# EAGLE design SpindlePidLcdStandAlone (EAGLE 6.3)
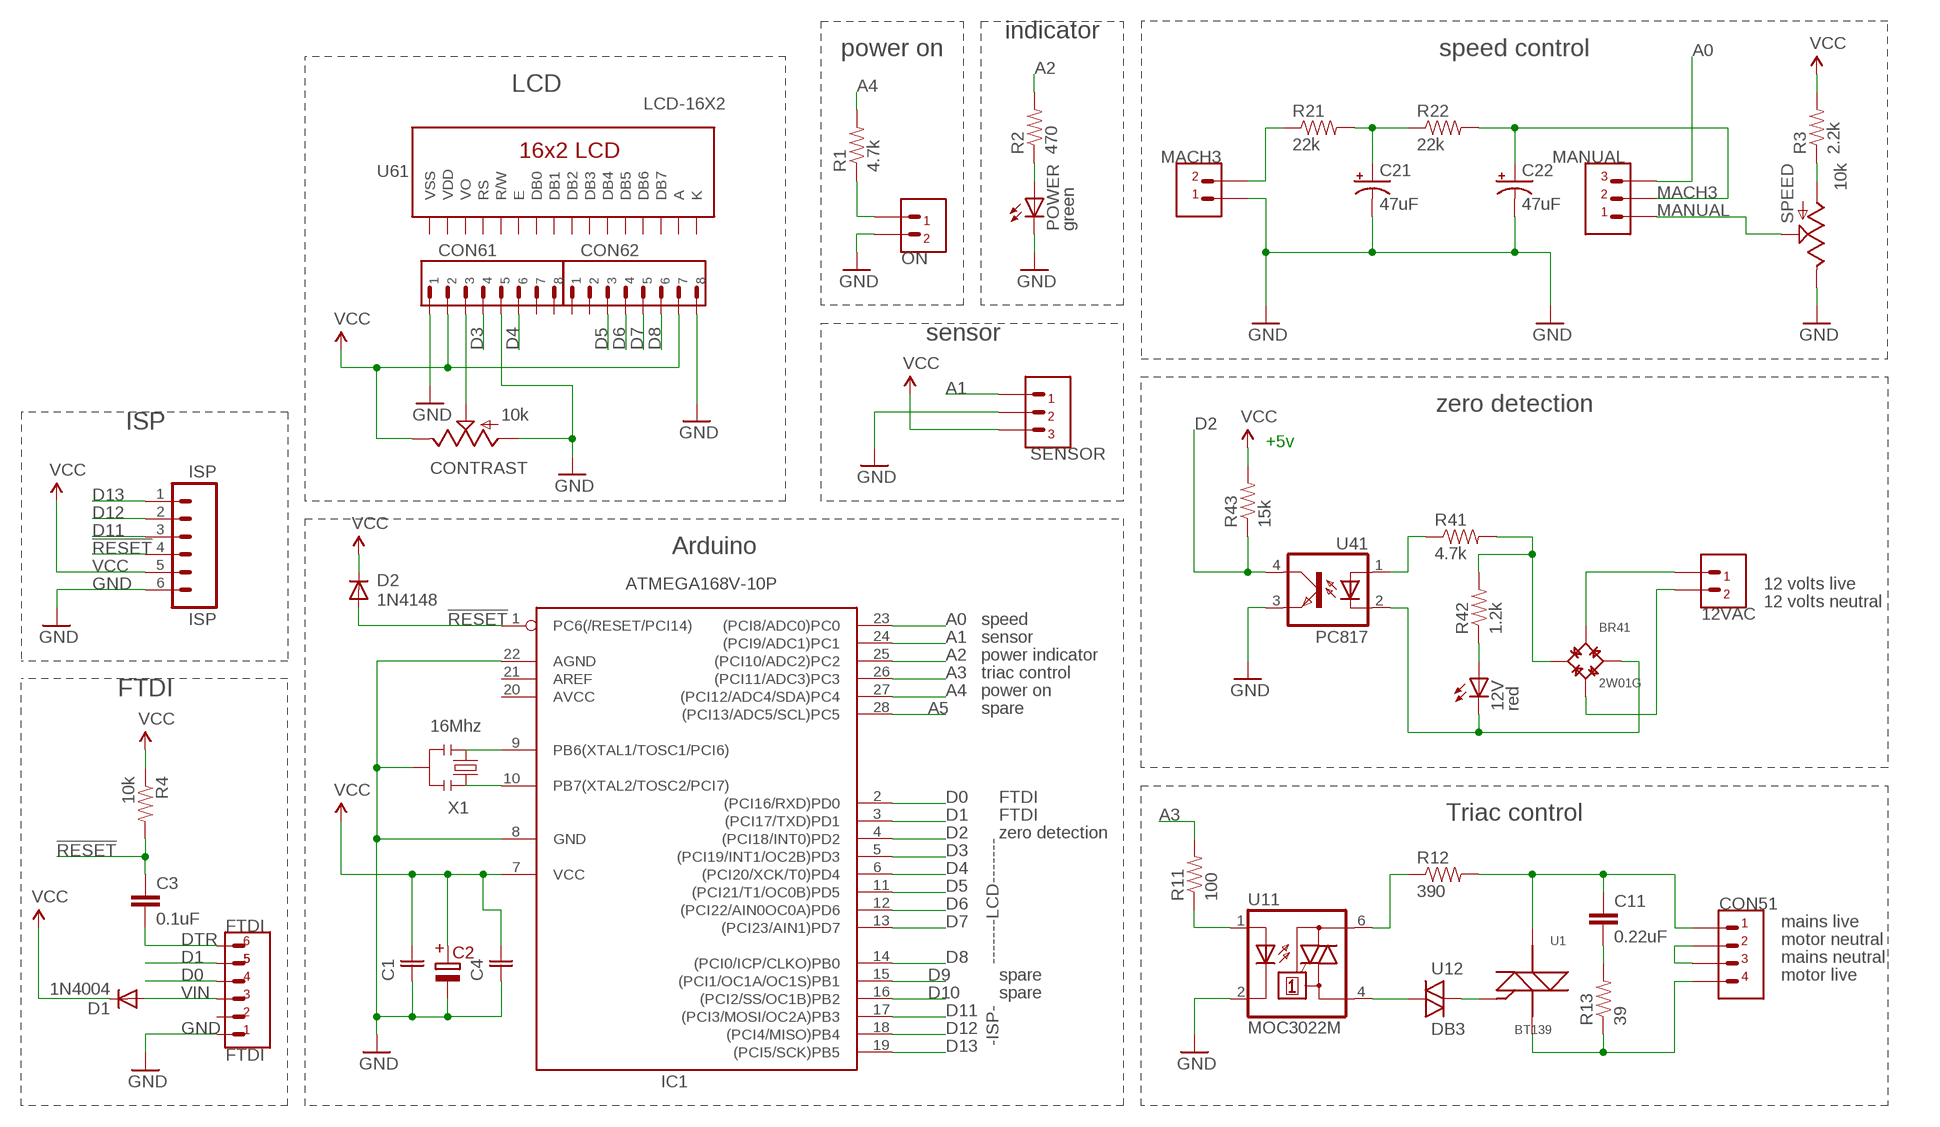
[diagram p0: schematic, sheet 1]

## Parts
12V  red  LED5MM  [LED5MM]
12VAC  2PIN  [2PIN]
BR41  2W01G  DIODEBRIDGE  [DIODEBRIDGE]
C1  0.1UF  [0.1UF]
C2  CAPACITOR  [CAPACITOR]
C3  0.1uF  CAPPTH  [CAP-PTH-SMALL]
C4  0.1UF  [0.1UF]
C11  0.22uF  CAPPTH  [CAP-PTH-SMALL]
C21  47uF  CAP_POLPTH2  [CPOL-RADIAL-10UF-25V]
C22  47uF  CAP_POLPTH2  [CPOL-RADIAL-10UF-25V]
CON51  4PIN  [4PIN]
CON61  8PINHEADER  [8PINHEADER]
CON62  8PINHEADER  [8PINHEADER]
CONTRAST  10k  POT  [ALPS_POT]
D1  1N4004  [DO41-10]
D2  1N4148  1N4004  [DO41-10]
FTDI  FTDI  6PINHEADER0.1"  [6PINHEADER]
IC1  ATMEGA168V-10P  [DIL28-3]
ISP  ISP  M06SIP  [1X06]
MACH3  2PIN  [2PIN]
MANUAL  3PIN  [3PIN]
ON  2PIN  [2PIN]
POWER  green  LED5MM  [LED5MM]
R1  4.7k  RESISTORPTH-1/4W  [AXIAL-0.4]
R2  470  RESISTORPTH-1/6W  [1/6W-RES]
R3  2.2k  RESISTORPTH-1/6W  [1/6W-RES]
R4  10k  RESISTORPTH-1/4W  [AXIAL-0.4]
R11  100  RESISTORPTH-1/6W  [1/6W-RES]
R12  390  RESISTORPTH-1/6W  [1/6W-RES]
R13  39  RESISTORPTH-1/6W  [1/6W-RES]
R21  22k  RESISTORPTH-1/6W  [1/6W-RES]
R22  22k  RESISTORPTH-1/6W  [1/6W-RES]
R41  4.7k  RESISTORPTH-1/6W  [1/6W-RES]
R42  1.2k  RESISTORPTH-1/6W  [1/6W-RES]
R43  15k  RESISTORPTH-1/6W  [1/6W-RES]
SENSOR  3PIN  [3PIN]
SPEED  10k  POT  [ALPS_POT]
U1  BT139  TRIAC  [TRIAC]
U11  MOC3022M  [DIL06]
U12  DB3  DIAC-DO35-10  [DO35-10]
U41  PC817  [DIL04]
U61  LCD-16X2  LCD-16X2SILK  [LCD-16X2]
X1  16Mhz  RESONATORPTH  [RESONATOR-PTH]

## Nets
!RESET: C3.1 D2.A IC1.1(PC6(/RESET/PCI14)) ISP.4 R4.P$2
A0: IC1.23((PCI8/ADC0)PC0) MANUAL.P$3
A1: IC1.24((PCI9/ADC1)PC1) SENSOR.P$1
A2: IC1.25((PCI10/ADC2)PC2) R2.2
A3: IC1.26((PCI11/ADC3)PC3) R11.2
A4: IC1.27((PCI12/ADC4/SDA)PC4) R1.P$2
A5: IC1.28((PCI13/ADC5/SCL)PC5)
D0: FTDI.P$4 IC1.2((PCI16/RXD)PD0)
D1: FTDI.P$5 IC1.3((PCI17/TXD)PD1)
D2: IC1.4((PCI18/INT0)PD2) R43.1 U41.4(COL)
D3: CON61.P$4 IC1.5((PCI19/INT1/OC2B)PD3)
D4: CON61.P$6 IC1.6((PCI20/XCK/T0)PD4)
D5: CON62.P$3 IC1.11((PCI21/T1/OC0B)PD5)
D6: CON62.P$4 IC1.12((PCI22/AIN0OC0A)PD6)
D7: CON62.P$5 IC1.13((PCI23/AIN1)PD7)
D8: CON62.P$6 IC1.14((PCI0/ICP/CLKO)PB0)
D9: IC1.15((PCI1/OC1A/OC1S)PB1)
D10: IC1.16((PCI2/SS/OC1B)PB2)
D11: IC1.17((PCI3/MOSI/OC2A)PB3) ISP.3
D12: IC1.18((PCI4/MISO)PB4) ISP.2
D13: IC1.19((PCI5/SCK)PB5) ISP.1
DTR: C3.2 FTDI.P$6
GND: C1.P$1 C2.-(-VE) C4.P$1 C21.2(-) C22.2(-) CON61.P$1 CON61.P$5 CON62.P$8 CONTRAST.P$3(A) FTDI.P$1 IC1.8(GND) IC1.22(AGND) ISP.6 MACH3.P$1 ON.P$2 POWER.K(C) SENSOR.P$2 SPEED.P$1(E) U11.2(C) U41.3(EMIT) X1.2
MACH3: C22.1(+) MANUAL.P$2 R22.2
MACH3_PWM: MACH3.P$2 R21.1
MAINS_LIVE: C11.1 CON51.P$1 R12.2 U1.2(A)
MANUAL: MANUAL.P$1 SPEED.P$2(S)
MOTOR_LIVE: CON51.P$4 R13.1 U1.3(C)
N$1: U1.1(B) U12.C
N$2: C21.1(+) R21.2 R22.1
N$3: U11.4(A1) U12.A
N$4: POWER.A R2.1
N$5: C11.2 R13.2
N$6: 12V.A R42.1
N$7: R41.1 U41.1(A)
N$8: 12V.K(C) BR41.- U41.2(C)
N$9: BR41.+ R41.2 R42.2
N$10: R3.1 SPEED.P$3(A)
N$11: IC1.9(PB6(XTAL1/TOSC1/PCI6)) X1.1
N$12: ON.P$1 R1.P$1
N$13: R11.1 U11.1(A)
N$14: 12VAC.P$1 BR41.AC1
N$15: R12.1 U11.6(A2)
N$16: 12VAC.P$2 BR41.AC2
N$17: CON61.P$3 CONTRAST.P$2(S)
N$18: IC1.10(PB7(XTAL2/TOSC2/PCI7)) X1.3
NEUTRAL: CON51.P$2 CON51.P$3
VCC: C1.P$2 C2.+(+VE) C4.P$2 CON61.P$2 CON62.P$7 CONTRAST.P$1(E) D1.C D2.C IC1.7(VCC) ISP.5 R3.2 R4.P$1 R43.2 SENSOR.P$3
VIN: D1.A FTDI.P$3
Unconnected: CON61.P$7 CON61.P$8 CON62.P$1 CON62.P$2 FTDI.P$2 IC1.20(AVCC) IC1.21(AREF) U61.3(VO) U61.4(RS) U61.5(R/W) U61.6(E) U61.7(DB0) U61.8(DB1) U61.9(DB2) U61.10(DB3) U61.11(DB4) U61.12(DB5) U61.13(DB6) U61.14(DB7)

## Notes on the sheet
- indicator
- power on | speed control
- LCD
- sensor
- zero detection
- ISP
- +5v
- Arduino
- 12 volts live
- 12 volts neutral
- speed
- sensor
- power indicator
- triac control
- FTDI | power on
- spare
- FTDI
- FTDI | Triac control
- zero detection
- -------LCD-------
- mains live
- motor neutral
- mains neutral
- spare | motor live
- spare
- -ISP-

## Power pins joined to a net without a drawn wire
A: U61.15(A)
K: U61.16(K)
VDD: U61.2(VDD)
VSS: U61.1(VSS)

## Library data of the parts
12V POWER = adafruit2012:LED: LED OSRAM: - CHIPLED LG R971, LG N971, LY N971, LG Q971, LY Q971, LO R971, LY R971 LH N974, LH R974 LS Q976, LO Q976, LY Q976 LO Q996 - Hyper CHIPLED LW Q18S LB Q993, LB Q99A, LB R99A - SideLED LS A670, LO A670, LY A670, LG A670, LP A670 LB A673, LV A673, LT A673, LW A673 LH A674 LY A675 LS A676, LA A676, LO A676, LY A676, LW A676 LS A679, LY A679, LG A679 - Hyper Micro SIDELED® LS Y876, LA Y876, LO Y876, LY Y876 LT Y87S - SmartLED LW L88C, LW L88S LB L89C, LB L89S, LG L890 LS L89K, LO L89K, LY L89K LS L896, LA L896, LO L896, LY L896 - TOPLED LS T670, LO T670, LY T670, LG T670, LP T670 LSG T670, LSP T670, LSY T670, LOP T670, LYG T670 LG T671, LOG T671, LSG T671 LB T673, LV T673, LT T673, LW T673 LH T674 LS T676, LA T676, LO T676, LY T676, LB T676, LH T676, LSB T676, LW T676 LB T67C, LV T67C, LT T67C, LS T67K, LO T67K, LY T67K, LW E67C LS E67B, LA E67B, LO E67B, LY E67B, LB E67C, LV E67C, LT E67C LW T67C LS T679, LY T679, LG T679 LS T770, LO T770, LY T770, LG T770, LP T770 LB T773, LV T773, LT T773, LW T773 LH T774 LS E675, LA E675, LY E675, LS T675 LS T776, LA T776, LO T776, LY T776, LB T776 LHGB T686 LT T68C, LB T68C - Hyper Mini TOPLED® LB M676 - Mini TOPLED Santana® LG M470 LS M47K, LO M47K, LY M47K Source: http://www.osram.convergy.de/
12VAC MACH3 ON = connectors:2PIN
BR41 = connectors:DIODEBRIDGE
C1 C4 = passives:0.1UF: 0.1uF 0.2" pitch
C2 = passives:CAPACITOR
C3 C11 = SparkFun:CAP: Capacitor Standard 0603 ceramic capacitor, and 0.1" leaded capacitor.
C21 C22 = SparkFun:CAP_POL: Capacitor Polarized These are standard SMD and PTH capacitors. Normally 10uF, 47uF, and 100uF in electrolytic and tantalum varieties. Always verify the external diameter of the through hole cap, it varies with capacity, voltage, and manufacturer. The EIA devices should be standard.
CON51 = connectors:4PIN
CON61 CON62 = connectors:8PINHEADER
CONTRAST SPEED = SparkFun:POT
D1 D2 = adafruit2012:1N4004: DIODE General purpose 1N400x type rectifier (With bigger pads) http://www.ladyada.net/library/pcb/eaglelibrary.html
FTDI = connectors:6PINHEADER
IC1 = adafruit2012:ATMEGA168*P: MICROCONTROLLER 16 kBytes FLASH 1 kBytes SRAM 512 Bytes EEPROM USART 8-channel 10 bit ADC
ISP = SparkFun:M06: Header 6 Standard 6-pin 0.1" header. Use with straight break away headers (SKU : PRT-00116), right angle break away headers (PRT-00553), swiss pins (PRT-00743), machine pins (PRT-00117), and female headers (PRT-00115). Molex polarized connector foot print use with SKU : PRT-08094 with associated crimp pins and housings. NOTES ON THE VARIANTS LOCK and LOCK_LONGPADS... This footprint was designed to help hold the alignment of a through-hole component (i.e. 6-pin header) while soldering it into place. You may notice that each hole has been shifted either up or down by 0.005 of an inch from it's more standard position (which is a perfectly straight line). This slight alteration caused the pins (the squares in the middle) to touch the edges of the holes. Because they are alternating, it causes a "brace" to hold the component in place. 0.005 has proven to be the perfect amount of "off-center" position when using our standard breakaway headers. Although looks a little odd when you look at the bare footprint, once you have a header in there, the alteration is very hard to notice. Also, if you push a header all the way into place, it is covered up entirely on the bottom side. This idea of altering the position of holes to aid alignment will be further integrated into the Sparkfun Library for other footprints. It can help hold any component with 3 or more connection pins.
MANUAL SENSOR = connectors:3PIN
R1-R4 R11-R13 R21 R22 R41-R43 = SparkFun:RESISTOR: Resistor Basic schematic elements and footprints for 0603, 1206, and PTH resistors.
U1 = connectors:TRIAC
U11 = optocoupler:MOC30*M: RANDOM-PHASE OPTOISOLATORS TRIAC DRIVER OUTPUT Source: http://www.fairchildsemi.com MOC3020-M.pdf; MF: FAIRCHILD SEMICONDUCTOR; MPN: MOC3022-M; OC_FARNELL: 1021086; OC_NEWARK: 58K1956
U12 = diode:DIAC-: DIAC
U41 = optocoupler:PC817: SHARP OPTO COUPLER; MPN: PC817X4J000F; OC_FARNELL: 9707727; OC_NEWARK: 97K7059
U61 = SparkFun:LCD-16X2
X1 = SparkFun:RESONATOR: Resonator Small SMD resonator. This is the itty bitty 10/20MHz resonators with built in caps. CSTCE10M0G55 and CSTCE20M0V53. Footprint has been reviewed closely but hasn't been tested yet.

## Board
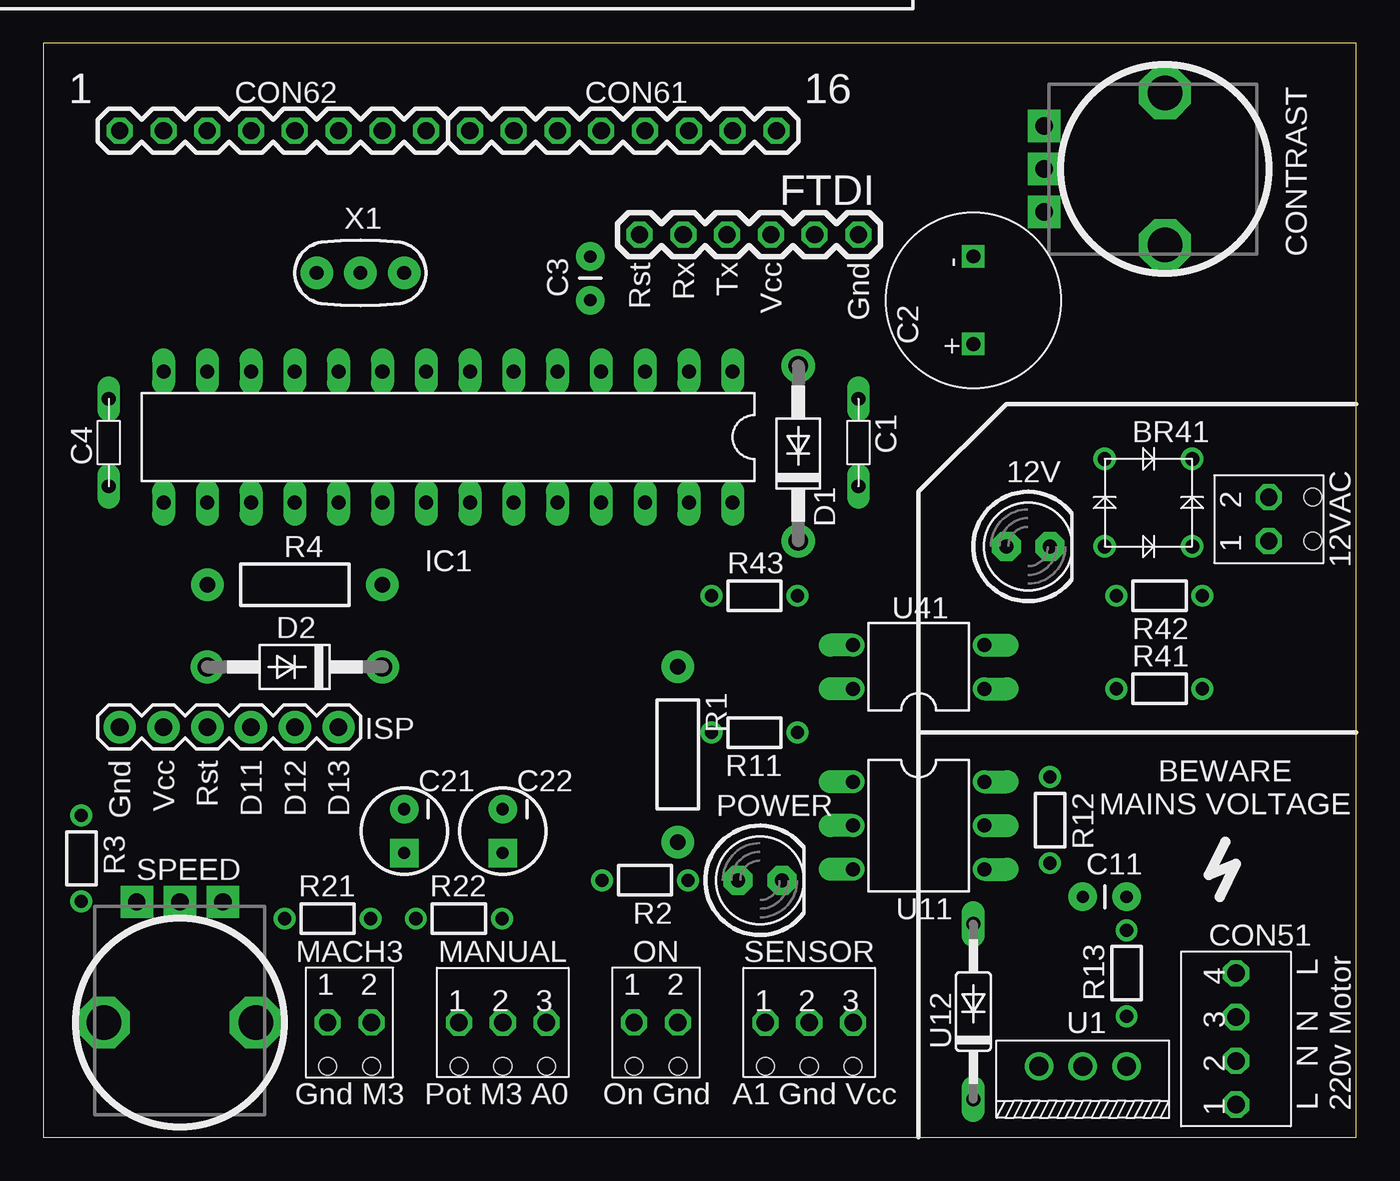
[diagram p1: board, top side]
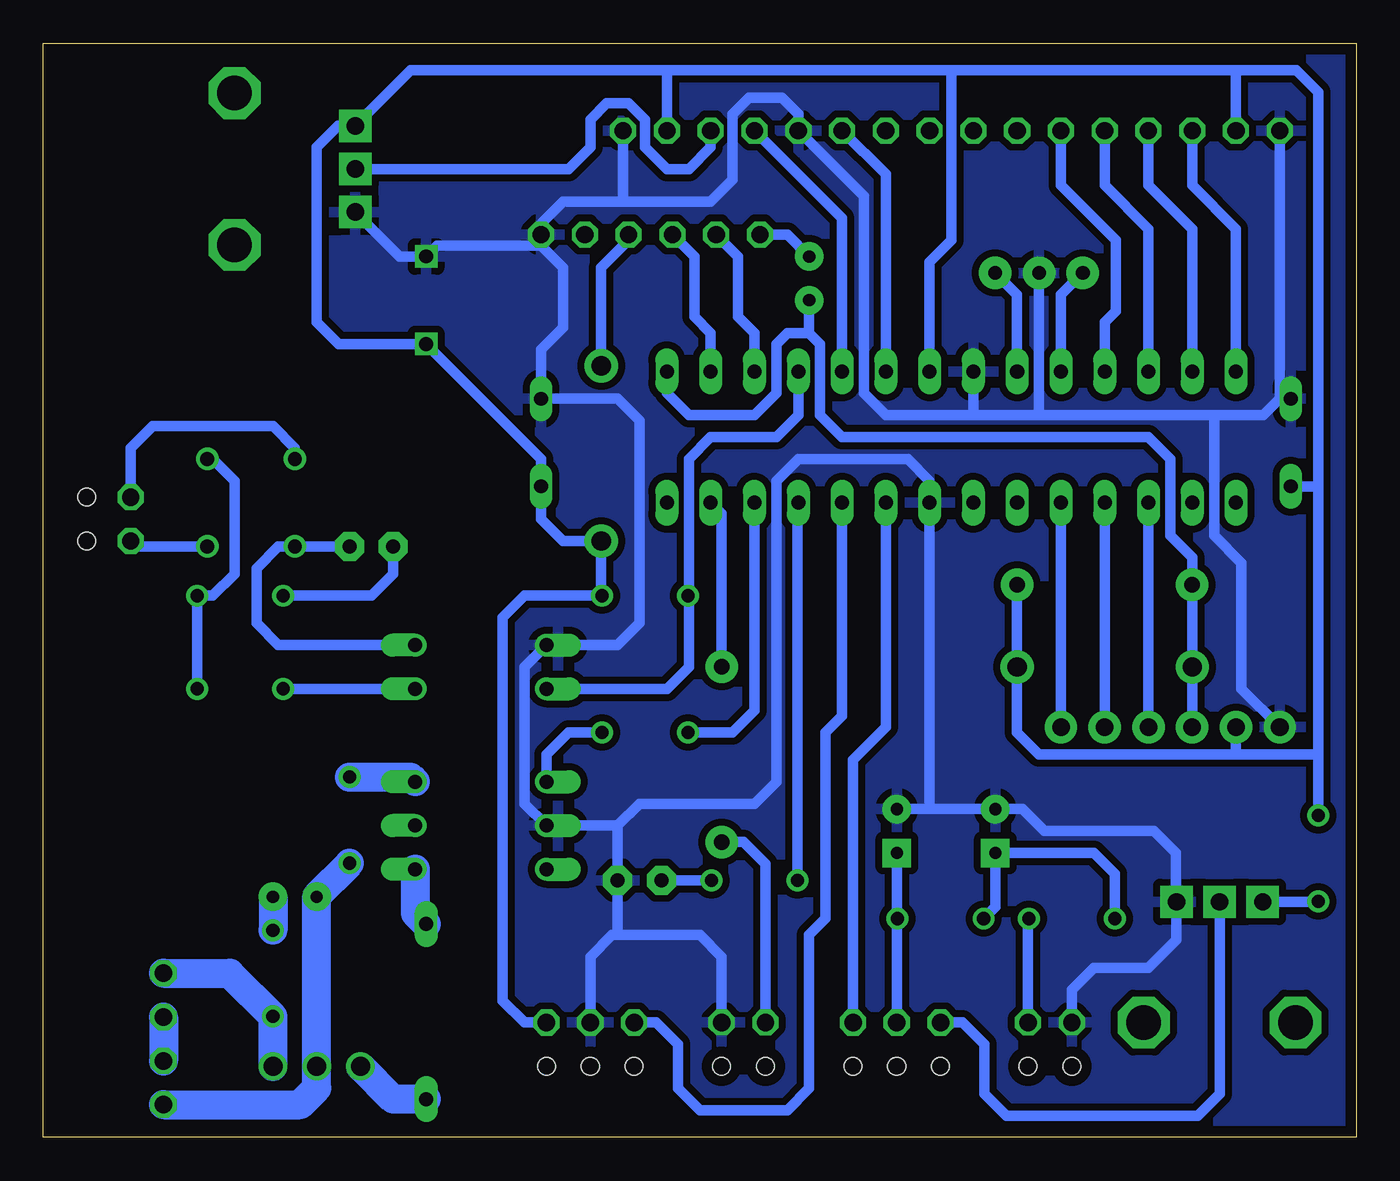
[diagram p2: board, bottom side, seen from below]

Size 76.2 x 63.5 mm. Coordinates in mm from the lower left corner, seen from the top.
Outline: 0,0 76.2,0 76.2,63.5 0,63.5 0,0
Copper layers (1*16): Top 0.035mm / dielectric 1.5mm / Bottom 0.035mm
Design rules "default *": minimum track width 10mil, minimum drill 24mil, track to track 16mil, track to pad 8mil, pad to pad 16mil, via to via 8mil, smd to smd 8mil, copper to edge 25mil, drill to drill 16mil, minimum pad ring 10mil, minimum via ring 8mil, stop-mask expansion 4mil, vias tented up to drill 0mil, thermal gap 16mil

### Footprints (pad centres in the part's own frame; a part is rotated, then mirrored left to right if it is on the bottom)
LED5MM = drill 0.813 pad 1.676 octagon: A -1.27,0; K 1.27,0
2PIN = drill 1 octagon: P$1 -1.27,0; P$2 1.27,0 | hole 1: -1.27,-2.54; 1.27,-2.54
DIODEBRIDGE = drill 0.8: + -2.54,2.54; - 2.54,-2.54; AC1 2.54,2.54; AC2 -2.54,-2.54
0.1UF = drill 0.8 long: P$1 -2.54,0; P$2 2.54,0
CAPACITOR = drill 0.8 square: + -2.54,0; - 2.54,0
CAP-PTH-SMALL = drill 0.7 pad 1.651: 1 0,0; 2 2.54,0
CPOL-RADIAL-10UF-25V = drill 0.7 pad 1.651 square: 1 1.27,0 | drill 0.7 pad 1.651: 2 -1.27,0
4PIN = drill 1.016 octagon: P$1 -3.81,0; P$2 -1.27,0; P$3 1.27,0; P$4 3.81,0
8PINHEADER = drill 1 octagon: P$1 -8.89,0; P$2 -6.35,0; P$3 -3.81,0; P$4 -1.27,0; P$5 1.27,0; P$6 3.81,0; P$7 6.35,0; P$8 8.89,0
ALPS_POT = drill 1 pad 1.88 square: P$1 7,-2.5; P$2 7,0; P$3 7,2.5 | drill 2 octagon: P$4 0,-4.4; P$5 0,4.4
DO41-10 = drill 1.118 pad 1.93: A 5.08,0; C -5.08,0
6PINHEADER = drill 1 octagon: P$1 -6.35,0; P$2 -3.81,0; P$3 -1.27,0; P$4 1.27,0; P$5 3.81,0; P$6 6.35,0
DIL28-3 = drill 0.813 long: 1 -16.51,-3.81; 2 -13.97,-3.81; 3 -11.43,-3.81; 4 -8.89,-3.81; 5 -6.35,-3.81; 6 -3.81,-3.81; 7 -1.27,-3.81; 8 1.27,-3.81; 9 3.81,-3.81; 10 6.35,-3.81; 11 8.89,-3.81; 12 11.43,-3.81; 13 13.97,-3.81; 14 16.51,-3.81; 15 16.51,3.81; 16 13.97,3.81; 17 11.43,3.81; 18 8.89,3.81; 19 6.35,3.81; 20 3.81,3.81; 21 1.27,3.81; 22 -1.27,3.81; 23 -3.81,3.81; 24 -6.35,3.81; 25 -8.89,3.81; 26 -11.43,3.81; 27 -13.97,3.81; 28 -16.51,3.81
1X06 = drill 1.016 pad 1.88: 1 0,0; 2 2.54,0; 3 5.08,0; 4 7.62,0; 5 10.16,0; 6 12.7,0
3PIN = drill 1.016 octagon: P$1 -2.54,0; P$2 0,0; P$3 2.54,0 | hole 1.016: -2.54,-2.54; 0,-2.54; 2.54,-2.54
AXIAL-0.4 = drill 0.9 pad 1.88: P$1 -5.08,0; P$2 5.08,0
1/6W-RES = drill 0.762: 1 -2.5,0; 2 2.5,0
TRIAC = drill 1.1: 1 -2.54,0; 2 0,0; 3 2.54,0
DIL06 = drill 0.813 offset: 1 -2.54,-3.81; 2 0,-3.81; 3 2.54,-3.81; 4 2.54,3.81; 5 0,3.81; 6 -2.54,3.81
DO35-10 = drill 0.813 long: A 5.08,0; C -5.08,0
DIL04 = drill 0.813 offset: 1 -1.27,-3.81; 2 1.27,-3.81; 3 1.27,3.81; 4 -1.27,3.81
LCD-16X2 = drill 1.016 pad 1.88 square: 1 -32,15.5 | drill 1.016 pad 1.88: 2 -29.46,15.5; 3 -26.92,15.5; 4 -24.38,15.5; 5 -21.84,15.5; 6 -19.3,15.5; 7 -16.76,15.5; 8 -14.22,15.5; 9 -11.68,15.5; 10 -9.14,15.5; 11 -6.6,15.5; 12 -4.06,15.5; 13 -1.52,15.5; 14 1.02,15.5; 15 3.56,15.5; 16 6.1,15.5 | hole 2.8: -37.5,15.5; -37.5,-15.5; 37.5,15.5; 37.5,-15.5
RESONATOR-PTH = drill 0.8 pad 1.88: 1 -2.54,0; 2 0,0; 3 2.54,0

### Placement (x,y rotation side)
12V  57.15,34.29 0 top
12VAC  71.12,35.88 90 top
BR41  64.14,36.83 270 top
C1  47.31,40.32 270 top
C2  53.98,48.58 90 top
C3  31.75,48.58 90 top
C4  3.81,40.32 270 top
C11  60.33,13.97 0 top
C21  20.95,17.78 270 top
C22  26.67,17.78 270 top
CON51  69.22,5.71 90 top
CON61  33.66,58.42 180 top
CON62  13.34,58.42 180 top
CONTRAST  65.09,56.2 180 top
D1  43.81,39.69 90 top
D2  14.61,27.3 180 top
FTDI  40.96,52.39 180 top
IC1  23.5,40.64 180 top
ISP  17.14,23.81 180 top
MACH3  17.78,6.67 0 top
MANUAL  26.67,6.67 0 top
ON  35.56,6.67 0 top
POWER  41.59,14.92 0 top
R1  36.83,22.23 90 top
R2  34.92,14.92 180 top
R3  2.22,16.19 90 top
R4  14.61,32.07 180 top
R11  41.27,23.5 180 top
R12  58.42,18.41 270 top
R13  62.87,9.53 90 top
R21  16.51,12.7 180 top
R22  24.13,12.7 0 top
R41  64.77,26.04 0 top
R42  64.77,31.43 0 top
R43  41.27,31.43 0 top
SENSOR  44.45,6.67 0 top
SPEED  7.94,6.67 90 top
U1  60.33,4.13 0 top
U11  50.8,18.1 270 top
U12  53.98,7.3 90 top
U41  50.8,27.3 90 top
U61  10.48,83.5 180 top  (outside the outline)
X1  18.41,50.16 180 top

### Tracks (layer width: path | path; a pad name or v marks a point on that pad's centre or on a via)
!RESET
  Bottom 0.61: IC1.1 40.01,43.18 38.73,41.91 34.92,41.91 33.66,43.18 33.66,46.04 33.02,46.67 31.75,46.67 | 31.75,46.67 31.11,46.04 31.11,41.91 29.84,40.64 12.06,40.64 10.79,39.37 10.79,34.92 9.53,33.66 R4.P$2 D2.A ISP.4 | C3.1 31.75,46.67
A0
  Bottom 0.61: IC1.23 27.3,23.81 29.21,21.91 MANUAL.P$3
A1
  Bottom 0.61: IC1.24 29.84,24.45 30.8,23.5 30.8,12.7 31.75,11.75 31.75,2.86 33.02,1.59 38.1,1.59 39.37,2.86 39.37,5.4 40.64,6.67 SENSOR.P$1
A2
  Bottom 0.61: R2.2 32.42,36.79 IC1.25
A3
  Bottom 0.61: R11.2 36.2,23.5 34.92,24.77 IC1.26
A4
  Bottom 0.61: R1.P$2 36.83,36.2 IC1.27
D0
  Bottom 0.61: FTDI.P$4 38.42,51.12 38.42,47.62 37.47,46.67 IC1.2
D1
  Bottom 0.61: FTDI.P$5 35.88,51.12 35.88,47.62 34.92,46.67 IC1.3
D2
  Bottom 0.61: 38.73,31.43 38.73,27.3 40.01,26.04 U41.4 | 38.73,31.43 38.73,39.37 37.47,40.64 33.66,40.64 32.38,41.91 IC1.4 | R43.1 38.73,31.43
D3
  Bottom 0.61: IC1.5 29.84,53.34 CON61.P$4
D4
  Bottom 0.61: IC1.6 27.3,55.88 CON61.P$6
D5
  Bottom 0.61: CON62.P$3 17.14,55.24 13.97,52.07 13.97,47.94 14.61,47.31 IC1.11
D6
  Bottom 0.61: IC1.12 12.06,52.7 14.61,55.24 CON62.P$4
D7
  Bottom 0.61: IC1.13 9.53,52.7 12.06,55.24 CON62.P$5
D8
  Bottom 0.61: IC1.14 6.99,52.7 9.53,55.24 CON62.P$6
D11
  Bottom 0.61: ISP.3 IC1.17
D12
  Bottom 0.61: ISP.2 IC1.18
D13
  Bottom 0.61: ISP.1 IC1.19
DTR
  Bottom 0.61: FTDI.P$6 33.02,52.39 C3.2
GND
  Bottom 0.61: 24.77,19.05 C21.2 19.37,19.05 18.1,17.78 11.75,17.78 10.48,16.51 10.48,13.71 SPEED.P$1 10.44,11.47 12.06,9.84 15.24,9.84 16.51,8.57 MACH3.P$1 | X1.2 18.41,41.91 | 18.41,41.91 8.26,41.91 | 8.26,41.91 5.4,41.91 4.45,42.86 | 4.45,42.86 CON62.P$8 | 22.23,41.91 27.3,41.91 28.57,43.18 28.57,54.61 CON61.P$5 32.38,59.37 33.34,60.33 35.24,60.33 36.2,59.37 36.2,55.56 37.47,54.29 42.55,54.29 | 22.23,41.91 18.41,41.91 | IC1.8 22.23,41.91 | 42.55,54.29 46.04,54.29 47.31,53.02 FTDI.P$1 47.31,51.75 | 47.31,51.75 53.34,51.75 C2.- 55.51,51.12 CONTRAST.P$3 | 47.31,51.75 46.04,50.48 46.04,46.99 47.31,45.72 C1.P$1 42.86,42.86 41.59,41.59 41.59,29.84 42.86,28.57 U41.3 48.26,27.3 48.26,19.37 U11.2 42.86,18.1 | CON61.P$1 42.55,54.29 | 42.86,18.1 41.59,19.37 34.92,19.37 33.66,20.64 33.66,38.1 32.38,39.37 26.04,39.37 24.77,38.1 IC1.22 24.77,19.05 | 42.86,18.1 POWER.K 42.86,11.75 | ISP.6 6.67,26.04 6.67,33.34 8.26,34.92 8.26,41.91 | C22.2 24.77,19.05 | C4.P$1 4.45,42.86 | ON.P$2 36.83,10.48 38.1,11.75 42.86,11.75 | 42.86,11.75 43.18,11.75 44.45,10.48 SENSOR.P$2
  pour Bottom: -0.64,64.77 77.15,64.77 77.15,23.5 50.8,23.5 50.8,-0.64 -0.64,-0.64
MACH3
  Bottom 0.61: MANUAL.P$2 26.67,12.66 R22.2 26.67,12.74 C22.1
MACH3_PWM
  Bottom 0.61: MACH3.P$2 19.05,12.66 R21.1
MAINS_LIVE
  Bottom 1.676: CON51.P$1 61.28,1.91 60.33,2.86 U1.2 C11.1 60.33,14.01 R12.2
MANUAL
  Bottom 0.61: SPEED.P$2 7.94,2.54 9.21,1.27 20.32,1.27 21.59,2.54 21.59,5.4 22.86,6.67 MANUAL.P$1
MOTOR_LIVE
  Bottom 1.676: U1.3 R13.1 65.36,9.53 CON51.P$4
N$1
  Bottom 1.676: U12.C 55.88,2.22 U1.1
N$2
  Bottom 0.61: R22.1 20.95,13.38 C21.1 15.24,16.51 14.01,15.28 R21.2
N$3
  Bottom 1.676: U11.4 54.61,13.02 U12.A
N$4
  Bottom 0.61: R2.1 POWER.A
N$5
  Bottom 1.676: C11.2 R13.2
N$6
  Bottom 0.61: 12V.A 55.88,32.7 57.15,31.43 R42.1
N$7
  Bottom 0.61: U41.1 R41.1
N$8
  Bottom 0.61: 12V.K BR41.- 62.55,34.29 63.82,33.02 63.82,29.84 62.55,28.57 U41.2
N$9
  Bottom 0.61: R41.2 R42.2 66.36,31.43 65.09,32.7 65.09,38.1 66.36,39.37 BR41.+
N$10
  Bottom 0.61: SPEED.P$3 2.25,13.67 R3.1
N$11
  Bottom 0.61: IC1.9 19.68,48.9 X1.1
N$12
  Bottom 0.61: ON.P$1 34.29,15.88 35.56,17.14 R1.P$1
N$13
  Bottom 0.61: R11.1 45.72,23.5 46.99,22.23 U11.1
N$14
  Bottom 0.61: BR41.AC1 70.8,34.29 12VAC.P$1
N$15
  Bottom 1.676: R12.1 54.89,20.91 U11.6
N$16
  Bottom 0.61: BR41.AC2 61.59,40.01 62.87,41.27 69.85,41.27 71.12,40.01 12VAC.P$2
N$17
  Bottom 0.61: CONTRAST.P$2 45.72,56.2 44.45,57.47 44.45,59.05 43.5,60.01 42.23,60.01 41.27,59.05 41.27,57.47 40.01,56.2 38.73,56.2 37.47,57.47 CON61.P$3
N$18
  Bottom 0.61: IC1.10 17.14,48.9 X1.3
NEUTRAL
  Bottom 1.676: CON51.P$3 CON51.P$2
VCC
  Bottom 0.61: CON62.P$7 6.99,61.91 | 6.99,61.91 23.5,61.91 | 23.5,61.91 23.5,52.07 24.77,50.8 IC1.7 | CON61.P$2 40.01,61.91 | 40.01,61.91 23.5,61.91 | 40.01,61.91 54.87,61.91 CONTRAST.P$1 59.09,58.7 60.33,57.47 60.33,47.31 59.05,46.04 C2.+ 47.31,39.37 C1.P$2 47.31,35.88 46.04,34.61 D1.C 43.81,31.43 R43.2 48.26,31.43 49.53,30.16 49.53,7.94 48.26,6.67 SENSOR.P$3 | 6.99,61.91 3.49,61.91 2.22,60.64 2.22,37.78 | R4.P$1 D2.C 19.68,23.5 18.41,22.23 6.99,22.23 | 2.22,22.23 6.99,22.23 | ISP.5 6.99,22.23 | 2.22,22.23 2.22,37.78 | C4.P$2 2.22,37.78 | R3.2 2.22,22.23
VIN
  Bottom 0.61: FTDI.P$3 42.23,52.07 43.81,50.48 D1.A

### Text on the board
tPlace: 1 | 16 | Rst / Rx / Tx / Vcc / / Gnd | Gnd / Vcc / Rst / D11 / D12 / D13 | BEWARE / MAINS VOLTAGE | N L / Motor | L N / 220v | Gnd M3 | Pot M3 A0 | On Gnd | A1 Gnd Vcc